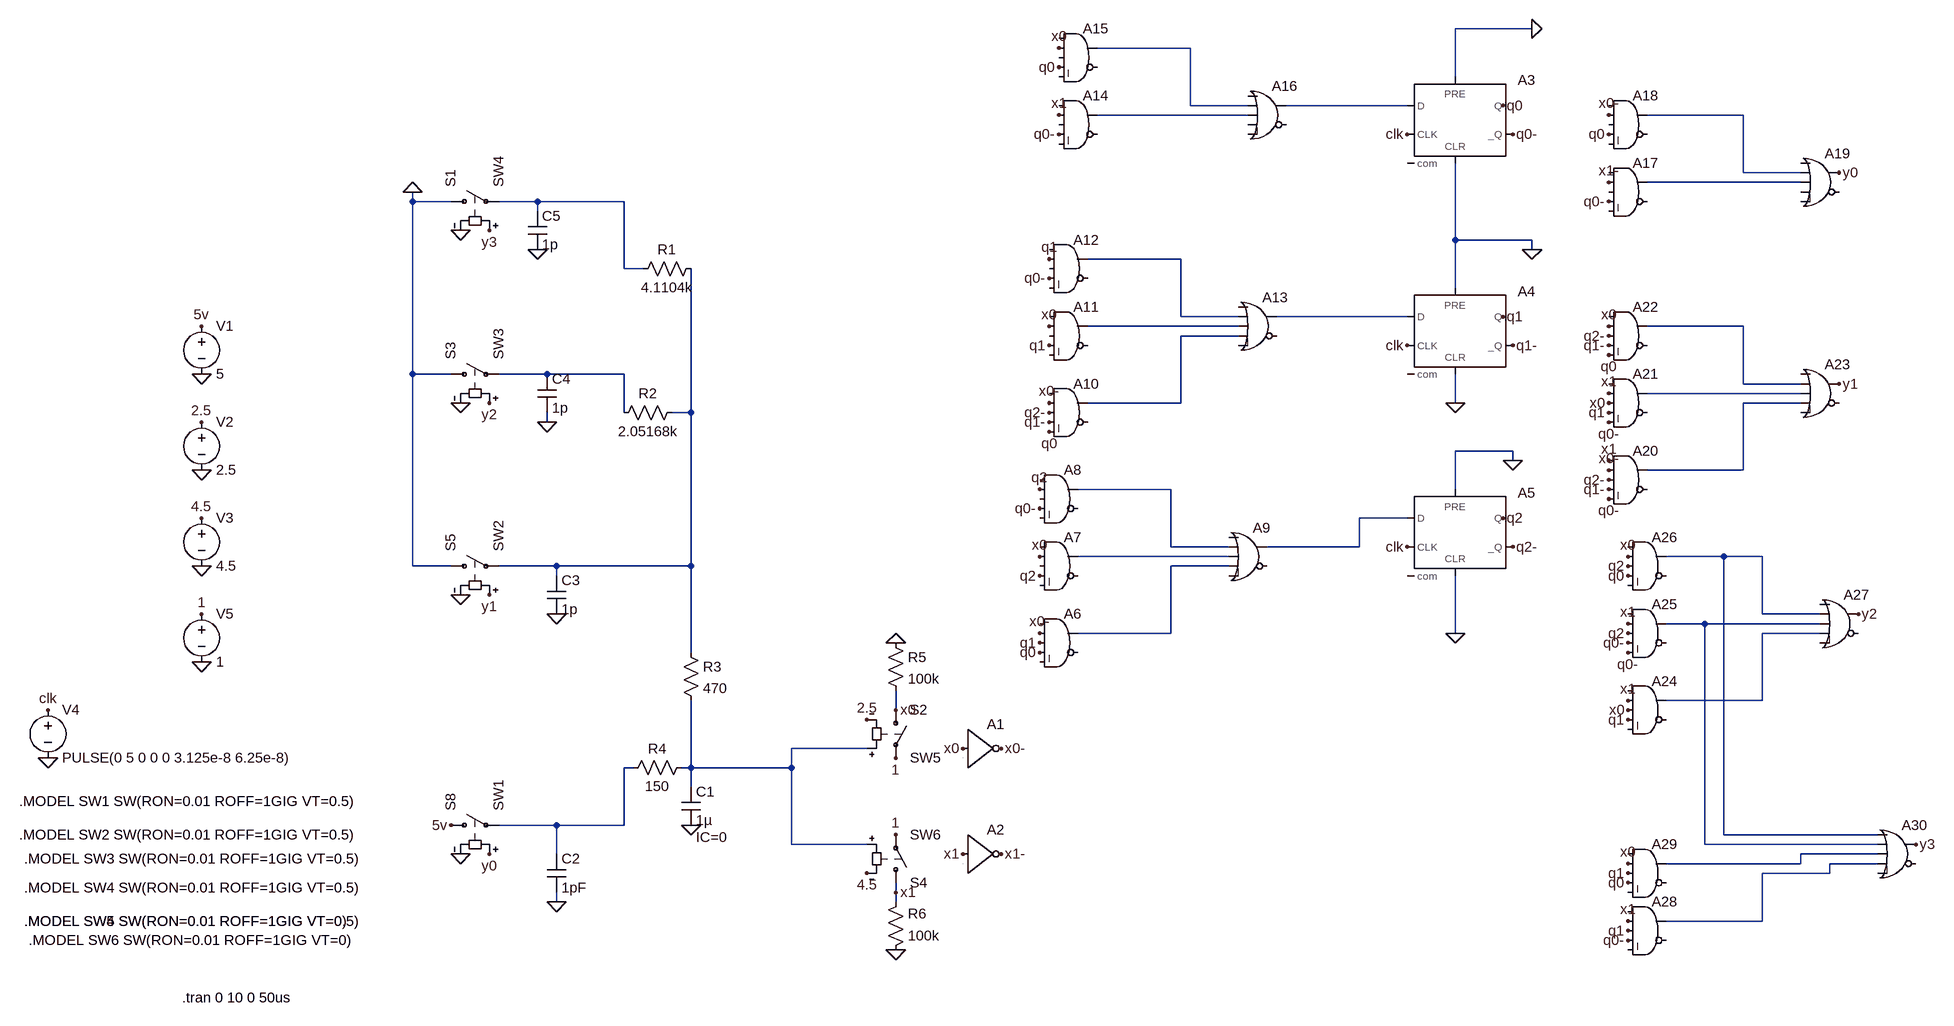
[diagram p0: schematic Draft11.asc]
Draft11.asc, the LTspice schematic file:
Version 4
SHEET 1 4108 1264
WIRE 1936 -368 1808 -368
WIRE 1248 -336 1088 -336
WIRE 1808 -288 1808 -368
WIRE 1248 -240 1248 -336
WIRE 1344 -240 1248 -240
WIRE 1728 -240 1408 -240
WIRE 1344 -224 1088 -224
WIRE 2288 -224 2128 -224
WIRE 2288 -128 2288 -224
WIRE 2384 -128 2288 -128
WIRE 2384 -112 2128 -112
WIRE -160 -80 -160 -96
WIRE -96 -80 -160 -80
WIRE 48 -80 -16 -80
WIRE 192 -80 48 -80
WIRE 48 -64 48 -80
WIRE 1808 -16 1808 -144
WIRE 1936 -16 1808 -16
WIRE 1936 0 1936 -16
WIRE 1232 16 1072 16
WIRE 192 32 192 -80
WIRE 224 32 192 32
WIRE 1808 64 1808 -16
WIRE 1232 112 1232 16
WIRE 1328 112 1232 112
WIRE 1728 112 1392 112
WIRE 1328 128 1072 128
WIRE 2288 128 2128 128
WIRE 1328 144 1232 144
WIRE -160 208 -160 -80
WIRE -96 208 -160 208
WIRE 64 208 -16 208
WIRE 192 208 64 208
WIRE 2288 224 2288 128
WIRE 2384 224 2288 224
WIRE 2384 240 2128 240
WIRE 1232 256 1232 144
WIRE 1232 256 1072 256
WIRE 1808 256 1808 208
WIRE 2384 256 2288 256
WIRE 192 272 192 208
WIRE 304 272 304 32
WIRE 304 272 272 272
WIRE 64 288 64 272
WIRE 1904 336 1808 336
WIRE 1904 352 1904 336
WIRE 2288 368 2288 256
WIRE 2288 368 2128 368
WIRE 1216 400 1056 400
WIRE 1808 400 1808 336
WIRE 1728 448 1648 448
WIRE 1216 496 1216 400
WIRE 1312 496 1216 496
WIRE 1648 496 1648 448
WIRE 1648 496 1376 496
WIRE 1312 512 1056 512
WIRE 2256 512 2160 512
WIRE 2320 512 2256 512
WIRE -160 528 -160 208
WIRE -96 528 -160 528
WIRE 80 528 -16 528
WIRE 304 528 304 272
WIRE 304 528 80 528
WIRE 1312 528 1216 528
WIRE 80 544 80 528
WIRE 2320 608 2320 512
WIRE 2416 608 2320 608
WIRE 2224 624 2160 624
WIRE 2416 624 2224 624
WIRE 1216 640 1216 528
WIRE 1216 640 1056 640
WIRE 1808 640 1808 544
WIRE 2416 640 2320 640
WIRE 304 672 304 528
WIRE 2320 752 2320 640
WIRE 2320 752 2160 752
WIRE 752 768 752 736
WIRE 704 832 560 832
WIRE 208 864 192 864
WIRE 304 864 304 752
WIRE 304 864 288 864
WIRE 560 864 560 832
WIRE 560 864 304 864
WIRE 304 896 304 864
WIRE 80 960 -16 960
WIRE 192 960 192 864
WIRE 192 960 80 960
WIRE 2256 976 2256 512
WIRE 2512 976 2256 976
WIRE 560 992 560 864
WIRE 704 992 560 992
WIRE 2224 992 2224 624
WIRE 2512 992 2224 992
WIRE 80 1008 80 960
WIRE 2512 1008 2384 1008
WIRE 2384 1024 2384 1008
WIRE 2384 1024 2160 1024
WIRE 2512 1024 2432 1024
WIRE 2432 1040 2432 1024
WIRE 2432 1040 2320 1040
WIRE 752 1072 752 1056
WIRE 80 1088 80 1072
WIRE 752 1088 752 1072
WIRE 2320 1120 2320 1040
WIRE 2320 1120 2160 1120
FLAG -160 -96 0
FLAG 304 960 0
FLAG -512 208 0
FLAG -512 128 5v
FLAG -96 960 5v
FLAG -512 368 0
FLAG -512 528 0
FLAG -512 288 2.5
FLAG -512 448 4.5
FLAG 864 832 x0
FLAG 864 1008 x1
FLAG 928 832 x0-
FLAG 928 1008 x1-
FLAG 1888 -240 q0
FLAG 1904 -192 q0-
FLAG 1888 112 q1
FLAG 1904 160 q1-
FLAG 1888 448 q2
FLAG 1904 496 q2-
FLAG 992 400 q2
FLAG 992 432 q0-
FLAG 992 512 x0
FLAG 992 544 q2
FLAG 992 640 x0-
FLAG 992 656 q1
FLAG 992 672 q0
FLAG 1008 48 q0-
FLAG 1008 128 x0
FLAG 1008 256 x0-
FLAG 1008 16 q1
FLAG 1008 160 q1
FLAG 1008 272 q2-
FLAG 1008 288 q1-
FLAG 1008 304 q0
FLAG 1024 -336 x0
FLAG 1024 -304 q0
FLAG 1024 -224 x1
FLAG 1024 -192 q0-
FLAG 2064 -192 q0
FLAG 2064 -80 q0-
FLAG 2064 -112 x1-
FLAG 2064 -224 x0-
FLAG 2448 -128 y0
FLAG 2064 128 x0
FLAG 2064 144 q2-
FLAG 2064 160 q1-
FLAG 2064 176 q0
FLAG 2064 240 x1
FLAG 2064 256 x0
FLAG 2064 272 q1
FLAG 2064 288 q0-
FLAG 2064 352 x1
FLAG 2064 368 x0-
FLAG 2064 384 q2-
FLAG 2064 400 q1-
FLAG 2064 416 q0-
FLAG 2096 672 q0-
FLAG 2096 512 x0
FLAG 2096 528 q2
FLAG 2096 544 q0
FLAG 2096 624 x1
FLAG 2096 640 q2
FLAG 2096 656 q0-
FLAG 2096 752 x1
FLAG 2096 768 x0
FLAG 2096 784 q1
FLAG 2096 1024 x0
FLAG 2096 1040 q1
FLAG 2096 1056 q0
FLAG 2096 1120 x1
FLAG 2096 1136 q1
FLAG 2096 1152 q0-
FLAG 2576 992 y3
FLAG 2480 608 y2
FLAG 2448 224 y1
FLAG -80 1008 0
FLAG -80 576 0
FLAG -80 -32 0
FLAG -80 256 0
FLAG -32 1008 y0
FLAG -32 576 y1
FLAG -32 256 y2
FLAG -32 -32 y3
FLAG -768 848 0
FLAG -768 768 clk
FLAG 1728 -192 clk
FLAG 1728 160 clk
FLAG 1728 496 clk
FLAG 80 1088 0
FLAG 80 608 0
FLAG 64 288 0
FLAG 48 0 0
FLAG 1808 256 0
FLAG 1936 0 0
FLAG 1936 -368 0
FLAG 1904 352 0
FLAG 1808 640 0
FLAG -512 688 0
FLAG -512 608 1
FLAG 704 784 2.5
FLAG 752 656 0
FLAG 752 768 x0
FLAG 752 848 1
FLAG 704 1040 4.5
FLAG 752 1168 0
FLAG 752 976 1
FLAG 752 1072 x1
SYMBOL res 320 16 R90
WINDOW 0 0 56 VBottom 2
WINDOW 3 32 56 VTop 2
SYMATTR InstName R1
SYMATTR Value 4.1104k
SYMBOL sw -112 -80 R270
SYMATTR InstName S1
SYMATTR Value SW4
SYMBOL sw -112 208 R270
SYMATTR InstName S3
SYMATTR Value SW3
SYMBOL sw -112 528 R270
SYMATTR InstName S5
SYMATTR Value SW2
SYMBOL sw -112 960 R270
SYMATTR InstName S8
SYMATTR Value SW1
SYMBOL res 288 256 R90
WINDOW 0 0 56 VBottom 2
WINDOW 3 32 56 VTop 2
SYMATTR InstName R2
SYMATTR Value 2.05168k
SYMBOL res 288 656 R0
SYMATTR InstName R3
SYMATTR Value 470
SYMBOL res 304 848 R90
WINDOW 0 0 56 VBottom 2
WINDOW 3 32 56 VTop 2
SYMATTR InstName R4
SYMATTR Value 150
SYMBOL cap 288 896 R0
WINDOW 123 24 84 Left 2
SYMATTR Value2 IC=0
SYMATTR InstName C1
SYMATTR Value 1µ
SYMBOL voltage -512 112 R0
WINDOW 123 0 0 Left 0
WINDOW 39 0 0 Left 0
SYMATTR InstName V1
SYMATTR Value 5
SYMBOL voltage -512 272 R0
WINDOW 123 0 0 Left 0
WINDOW 39 0 0 Left 0
SYMATTR InstName V2
SYMATTR Value 2.5
SYMBOL voltage -512 432 R0
WINDOW 123 0 0 Left 0
WINDOW 39 0 0 Left 0
SYMATTR InstName V3
SYMATTR Value 4.5
SYMBOL Digital\\inv 864 768 R0
SYMATTR InstName A1
SYMBOL Digital\\inv 864 944 R0
SYMATTR InstName A2
SYMBOL Digital\\dflop 1808 -288 R0
SYMATTR InstName A3
SYMBOL Digital\\dflop 1808 64 R0
SYMATTR InstName A4
SYMBOL Digital\\dflop 1808 400 R0
SYMATTR InstName A5
SYMBOL Digital\\and 1024 592 R0
SYMATTR InstName A6
SYMBOL Digital\\and 1024 464 R0
SYMATTR InstName A7
SYMBOL Digital\\and 1024 352 R0
SYMATTR InstName A8
SYMBOL Digital\\or 1344 448 R0
SYMATTR InstName A9
SYMBOL Digital\\and 1040 208 R0
SYMATTR InstName A10
SYMBOL Digital\\and 1040 80 R0
SYMATTR InstName A11
SYMBOL Digital\\and 1040 -32 R0
SYMATTR InstName A12
SYMBOL Digital\\or 1360 64 R0
SYMATTR InstName A13
SYMBOL Digital\\and 1056 -272 R0
SYMATTR InstName A14
SYMBOL Digital\\and 1056 -384 R0
SYMATTR InstName A15
SYMBOL Digital\\or 1376 -288 R0
SYMATTR InstName A16
SYMBOL Digital\\and 2096 -160 R0
SYMATTR InstName A17
SYMBOL Digital\\and 2096 -272 R0
SYMATTR InstName A18
SYMBOL Digital\\or 2416 -176 R0
SYMATTR InstName A19
SYMBOL Digital\\and 2096 320 R0
SYMATTR InstName A20
SYMBOL Digital\\and 2096 192 R0
SYMATTR InstName A21
SYMBOL Digital\\and 2096 80 R0
SYMATTR InstName A22
SYMBOL Digital\\or 2416 176 R0
SYMATTR InstName A23
SYMBOL Digital\\and 2128 704 R0
SYMATTR InstName A24
SYMBOL Digital\\and 2128 576 R0
SYMATTR InstName A25
SYMBOL Digital\\and 2128 464 R0
SYMATTR InstName A26
SYMBOL Digital\\or 2448 560 R0
SYMATTR InstName A27
SYMBOL Digital\\and 2128 1072 R0
SYMATTR InstName A28
SYMBOL Digital\\and 2128 976 R0
SYMATTR InstName A29
SYMBOL Digital\\or 2544 944 R0
SYMATTR InstName A30
SYMBOL voltage -768 752 R0
WINDOW 123 0 0 Left 0
WINDOW 39 0 0 Left 0
SYMATTR InstName V4
SYMATTR Value PULSE(0 5 0 0 0 3.125e-8 6.25e-8)
SYMBOL voltage -512 592 R0
WINDOW 123 0 0 Left 0
WINDOW 39 0 0 Left 0
SYMATTR InstName V5
SYMATTR Value 1
SYMBOL cap 64 1008 R0
SYMATTR InstName C2
SYMATTR Value 1pF
SYMBOL cap 64 544 R0
SYMATTR InstName C3
SYMATTR Value 1p
SYMBOL sw 752 752 R0
SYMATTR InstName S2
SYMATTR Value SW5
SYMBOL res 736 640 R0
SYMATTR InstName R5
SYMATTR Value 100k
SYMBOL sw 752 1072 M180
SYMATTR InstName S4
SYMATTR Value SW6
SYMBOL res 736 1184 M180
WINDOW 0 36 76 Left 2
WINDOW 3 36 40 Left 2
SYMATTR InstName R6
SYMATTR Value 100k
SYMBOL cap 48 208 R0
SYMATTR InstName C4
SYMATTR Value 1p
SYMBOL cap 32 -64 R0
SYMATTR InstName C5
SYMATTR Value 1p
TEXT -544 1248 Left 2 !.tran 0 10 0 50us
TEXT -816 920 Left 2 !.MODEL SW1 SW(RON=0.01 ROFF=1GIG VT=0.5)
TEXT -816 976 Left 2 !.MODEL SW2 SW(RON=0.01 ROFF=1GIG VT=0.5)
TEXT -808 1064 Left 2 !.MODEL SW4 SW(RON=0.01 ROFF=1GIG VT=0.5)
TEXT -808 1016 Left 2 !.MODEL SW3 SW(RON=0.01 ROFF=1GIG VT=0.5)
TEXT -808 1120 Left 2 !.MODEL SW5 SW(RON=0.01 ROFF=1GIG VT=0)
TEXT -808 1120 Left 2 !.MODEL SW4 SW(RON=0.01 ROFF=1GIG VT=0.5)
TEXT -800 1152 Left 2 !.MODEL SW6 SW(RON=0.01 ROFF=1GIG VT=0)

The netlist it stands for:
* Draft11.asc
R1 N015 N006 4.1104k
S1 0 N006 y3 0 SW4
S3 0 N012 y2 0 SW3
S5 0 N015 y1 0 SW2
S8 5v N024 y0 0 SW1
R2 N015 N012 2.05168k
R3 N015 N023 470
R4 N023 N024 150
C1 N023 0 1µ IC=0
V1 5v 0 5
V2 2.5 0 2.5
V3 4.5 0 4.5
A1 x0 0 0 0 0 x0- 0 0 BUF
A2 x1 0 0 0 0 x1- 0 0 BUF
A3 N002 0 clk 0 0 q0- q0 0 DFLOP
A4 N008 0 clk 0 0 q1- q1 0 DFLOP
A5 N017 0 clk 0 0 q2- q2 0 DFLOP
A6 0 x0- q1 q0 0 0 N020 0 AND
A7 0 x0 0 q2 0 0 N018 0 AND
A8 0 q2 0 q0- 0 0 N016 0 AND
A9 0 N016 N018 N020 0 0 N017 0 OR
A10 0 x0- q2- q1- q0 0 N011 0 AND
A11 0 x0 0 q1 0 0 N009 0 AND
A12 0 q1 0 q0- 0 0 N007 0 AND
A13 0 N007 N009 N011 0 0 N008 0 OR
A14 0 x1 0 q0- 0 0 N003 0 AND
A15 0 x0 0 q0 0 0 N001 0 AND
A16 0 N001 N003 0 0 0 N002 0 OR
A17 0 x1- 0 q0- 0 0 N005 0 AND
A18 0 x0- 0 q0 0 0 N004 0 AND
A19 0 N004 N005 0 0 0 y0 0 OR
A20 x1 x0- q2- q1- q0- 0 N014 0 AND
A21 0 x1 x0 q1 q0- 0 N013 0 AND
A22 0 x0 q2- q1- q0 0 N010 0 AND
A23 0 N010 N013 N014 0 0 y1 0 OR
A24 0 x1 x0 q1 0 0 N022 0 AND
A25 0 x1 q2 q0- q0- 0 N021 0 AND
A26 0 x0 q2 q0 0 0 N019 0 AND
A27 0 N019 N021 N022 0 0 y2 0 OR
A28 0 x1 q1 q0- 0 0 N026 0 AND
A29 0 x0 q1 q0 0 0 N025 0 AND
A30 N019 N021 N025 N026 0 0 y3 0 OR
V4 clk 0 PULSE(0 5 0 0 0 3.125e-8 6.25e-8)
V5 1 0 1
C2 N024 0 1pF
C3 N015 0 1p
S2 x0 1 N023 2.5 SW5
R5 0 x0 100k
S4 x1 1 N023 4.5 SW6
R6 0 x1 100k
C4 N012 0 1p
C5 N006 0 1p
.tran 0 10 0 50us
.MODEL SW1 SW(RON=0.01 ROFF=1GIG VT=0.5)
.MODEL SW2 SW(RON=0.01 ROFF=1GIG VT=0.5)
.MODEL SW4 SW(RON=0.01 ROFF=1GIG VT=0.5)
.MODEL SW3 SW(RON=0.01 ROFF=1GIG VT=0.5)
.MODEL SW5 SW(RON=0.01 ROFF=1GIG VT=0)
.MODEL SW4 SW(RON=0.01 ROFF=1GIG VT=0.5)
.MODEL SW6 SW(RON=0.01 ROFF=1GIG VT=0)
.backanno
.end